# EAGLE design GRRVboardCGROUP2015 (EAGLE 7.4.0)
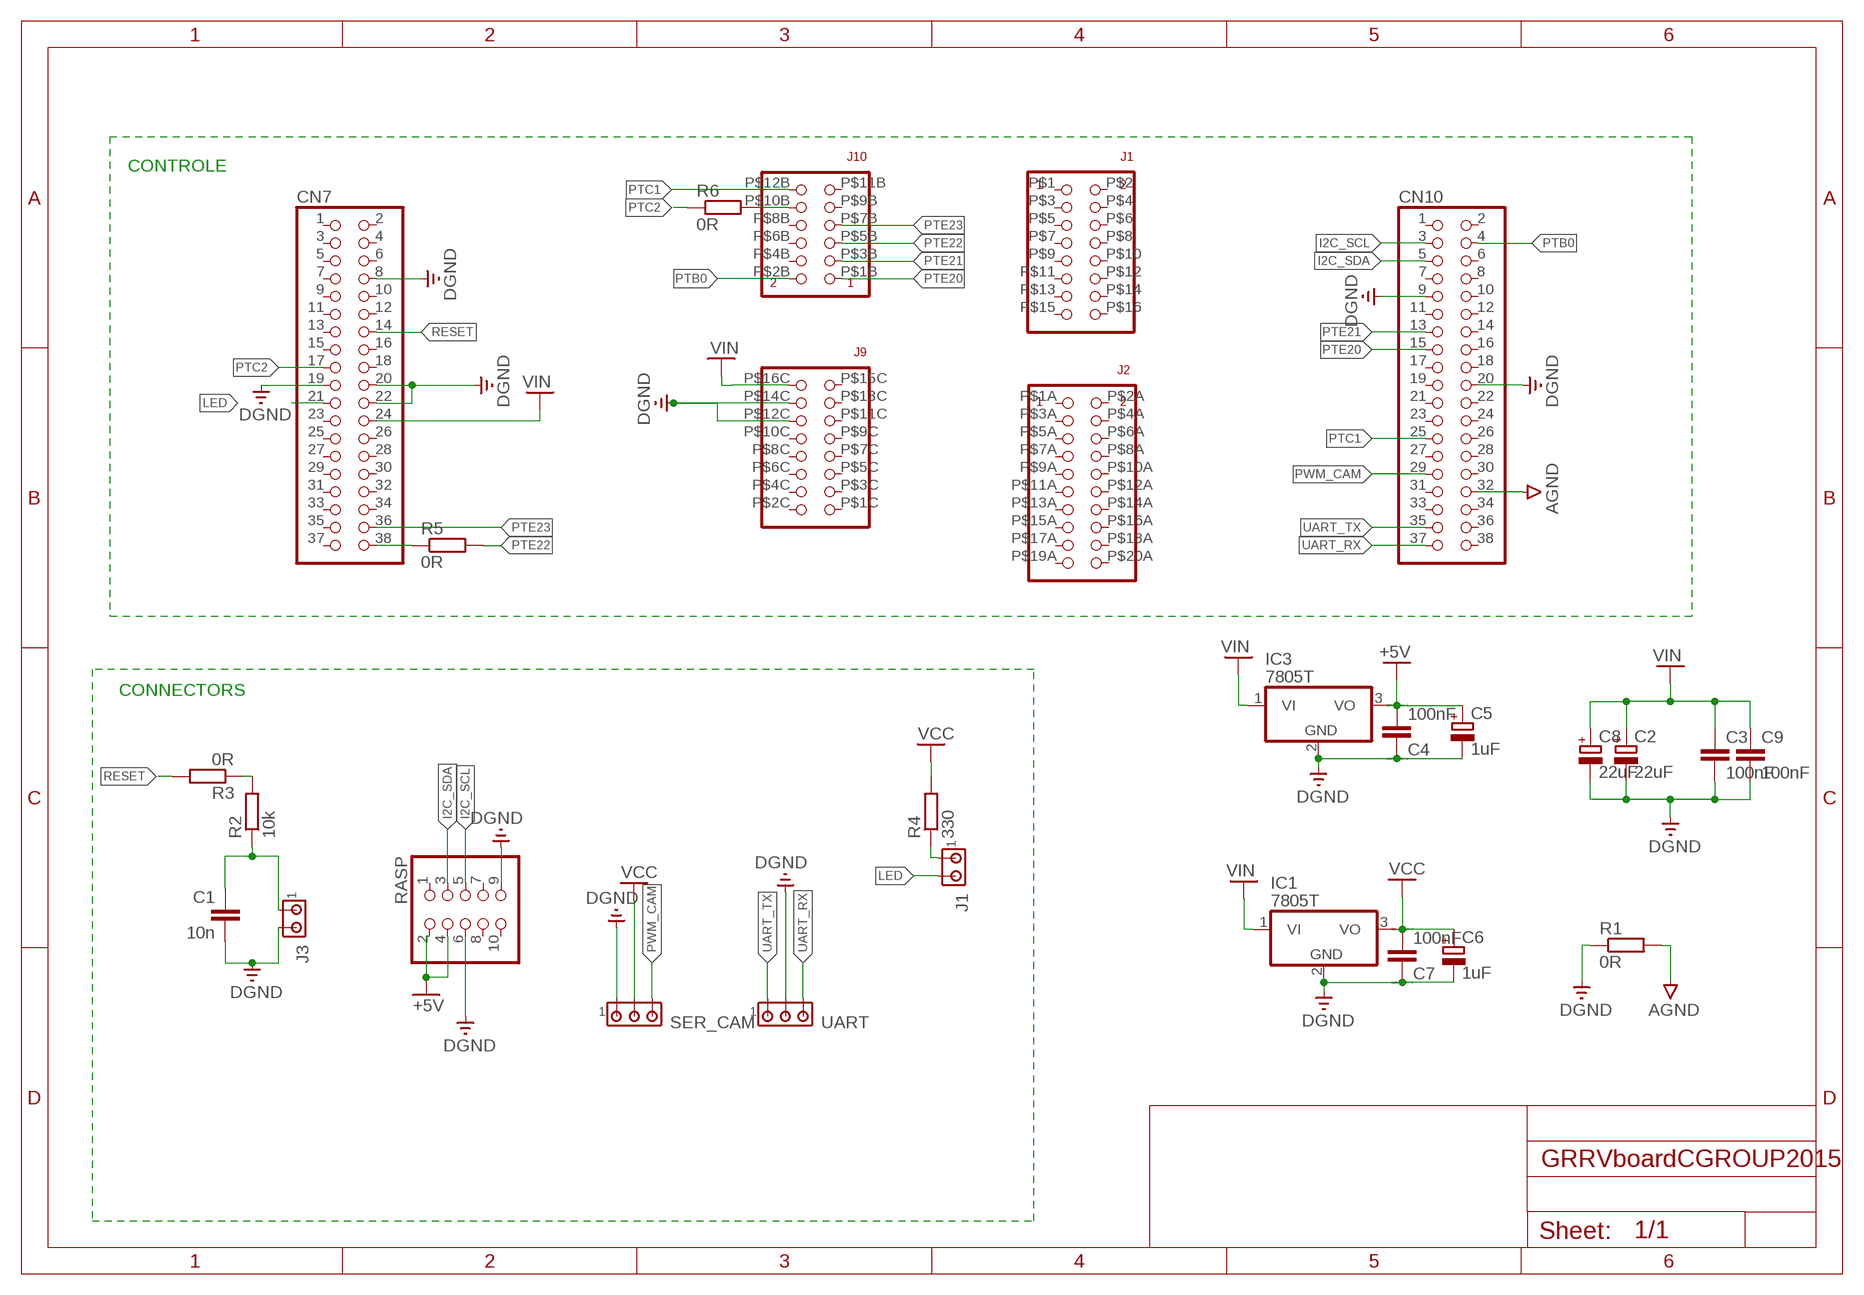
[diagram p0: schematic, sheet 1]

## Parts
C1  10n  C-EUC0805  [C0805]
C2  22uF  CPOL-EUSMCB  [SMC_B]
C3  100nF  C-EUC0805  [C0805]
C4  100nF  C  [C0805]
C5  1uF  CPOL-EUSMCB  [SMC_B]
C6  1uF  CPOL-EUSMCB  [SMC_B]
C7  100nF  C  [C0805]
C8  22uF  CPOL-EUSMCB  [SMC_B]
C9  100nF  C-EUC0805  [C0805]
CN7  PINHD-2X19  [2X19]
CN10  PINHD-2X19  [2X19]
IC1  7805T  [TO220H]
IC3  7805T  [TO220H]
J1  MTA02-100  [10X02MTA]
J3  MTA02-100  [10X02MTA]
R1  0R  R-EU_M1206  [M1206]
R2  10k  R-EU_M0805  [M0805]
R3  0R  R-EU_R0805  [R0805]
R4  330  R-EU_M0805  [M0805]
R5  0R  R-EU_R0805  [R0805]
R6  0R  R-EU_R0805  [R0805]
RASP  PINHD-2X5  [2X05]
SER_CAM  MTA03-100  [10X03MTA]
U$1  FRDM-TFC  [FRDM]
UART  MTA03-100  [10X03MTA]

## Nets
+5V: C4.2 C5.+ IC3.3(VO) RASP.2 RASP.4
AGND: CN10.32 R1.2
DGND: C1.2 C2.- C3.2 C4.1 C5.- C6.- C7.1 C8.- C9.2 CN7.8 CN7.19 CN7.20 CN7.22 CN10.9 CN10.20 IC1.2(GND) IC3.2(GND) J3.2 R1.1 RASP.6 RASP.9 SER_CAM.1 U$1.P$12C(12C) U$1.P$14C(14C) UART.2
I2C_SCL: CN10.3 RASP.5
I2C_SDA: CN10.5 RASP.3
LED: CN7.21 J1.2
N$3: CN7.38 R5.1
N$7: R2.2 R3.1
N$8: J1.1 R4.1
N$10: R6.2 U$1.P$10B(10B)
N$17: C1.1 J3.1 R2.1
PTB0: CN10.4 U$1.P$2B(2B)
PTC1: CN10.25 U$1.P$12B(12B)
PTC2: CN7.17 R6.1
PTE20: CN10.15 U$1.P$1B(1B)
PTE21: CN10.13 U$1.P$3B(3B)
PTE22: R5.2 U$1.P$5B(5B)
PTE23: CN7.36 U$1.P$7B(7B)
PWM_CAM: CN10.29 SER_CAM.3
RESET: CN7.14 R3.2
UART_RX: CN10.37 UART.3
UART_TX: CN10.35 UART.1
VCC: C6.+ C7.2 IC1.3(VO) R4.2 SER_CAM.2
VIN: C2.+ C3.1 C8.+ C9.1 CN7.24 IC1.1(VI) IC3.1(VI) U$1.P$16C(16C)
Unconnected: CN7.1 CN7.2 CN7.3 CN7.4 CN7.5 CN7.6 CN7.7 CN7.9 CN7.10 CN7.11 CN7.12 CN7.13 CN7.15 CN7.16 CN7.18 CN7.23 CN7.25 CN7.26 CN7.27 CN7.28 CN7.29 CN7.30 CN7.31 CN7.32 CN7.33 CN7.34 CN7.35 CN7.37 CN10.1 CN10.2 CN10.6 CN10.7 CN10.8 CN10.10 CN10.11 CN10.12 CN10.14 CN10.16 CN10.17 CN10.18 CN10.19 CN10.21 CN10.22 CN10.23 CN10.24 CN10.26 CN10.27 CN10.28 CN10.30 CN10.31 CN10.33 CN10.34 CN10.36 CN10.38 RASP.1 RASP.7 RASP.8 RASP.10 U$1.P$1 U$1.P$1A(1A) U$1.P$1C(1C) U$1.P$2 U$1.P$2A(2A) U$1.P$2C(2C) U$1.P$3 U$1.P$3A(3A) U$1.P$3C(3C) U$1.P$4 U$1.P$4A(4A) U$1.P$4B(4B) U$1.P$4C(4C) U$1.P$5 U$1.P$5A(5A) U$1.P$5C(5C) U$1.P$6 U$1.P$6A(6A) U$1.P$6B(6B) U$1.P$6C(6C) U$1.P$7 U$1.P$7A(7A) U$1.P$7C(7C) U$1.P$8 U$1.P$8A(8A) U$1.P$8B(8B) U$1.P$8C(8C) U$1.P$9 U$1.P$9A(9A) U$1.P$9B(9B) U$1.P$9C(9C) U$1.P$10 U$1.P$10A(10A) U$1.P$10C(10C) U$1.P$11 U$1.P$11A(11A) U$1.P$11B(11B) U$1.P$11C(11C) U$1.P$12 U$1.P$12A(12A) U$1.P$13 U$1.P$13A(13A) U$1.P$13C(13C) U$1.P$14 U$1.P$14A(14A) U$1.P$15 U$1.P$15A(15A) U$1.P$15C(15C) U$1.P$16 U$1.P$16A(16A) U$1.P$17A(17A) U$1.P$18A(18A) U$1.P$19A(19A) U$1.P$20A(20A)

## Notes on the sheet
- CONTROLE
- CONNECTORS

## Library data of the parts
C1 C3 C9 = resistor:C-EU: CAPACITOR, European symbol
C2 C5 C6 C8 = resistor:CPOL-EU: POLARIZED CAPACITOR, European symbol
C4 C7 = eagle-ltspice:C: CAPACITOR, European symbol; SPICEMODEL: NONE; SPICEPREFIX: C
CN7 CN10 = pinhead:PINHD-2X19: PIN HEADER
IC1 IC3 = linear:78*: Positive VOLTAGE REGULATOR Source: http://cache.national.com/ds/LM/LM78L05.pdf http://www.fairchildsemi.com/ds/LM/LM7805.pdf
J1 J3 = con-amp:MTA02-100: AMP connector
R1 R2 R4 = resistor:R-EU_: RESISTOR, European symbol
R3 R5 R6 = rcl:R-EU_: RESISTOR, European symbol
RASP = pinhead:PINHD-2X5: PIN HEADER
SER_CAM UART = con-amp:MTA03-100: AMP connector
U$1 = 21092015_projIntensif:FRDM-TFC

## Board
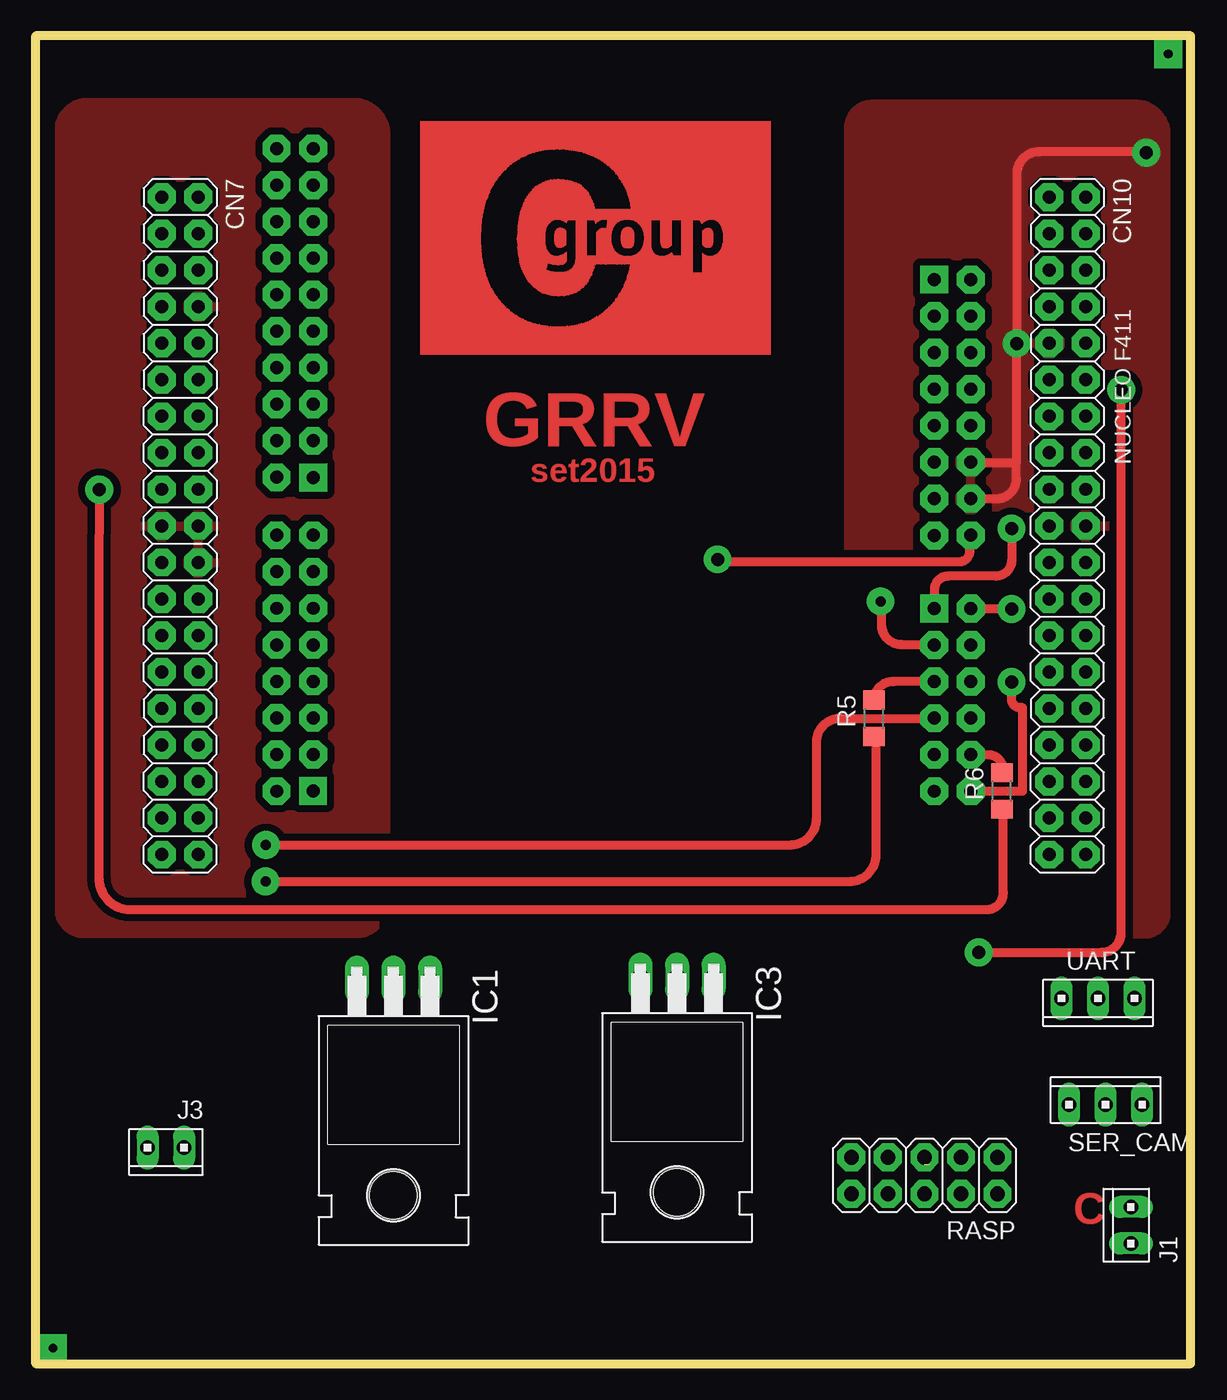
[diagram p1: board, top side]
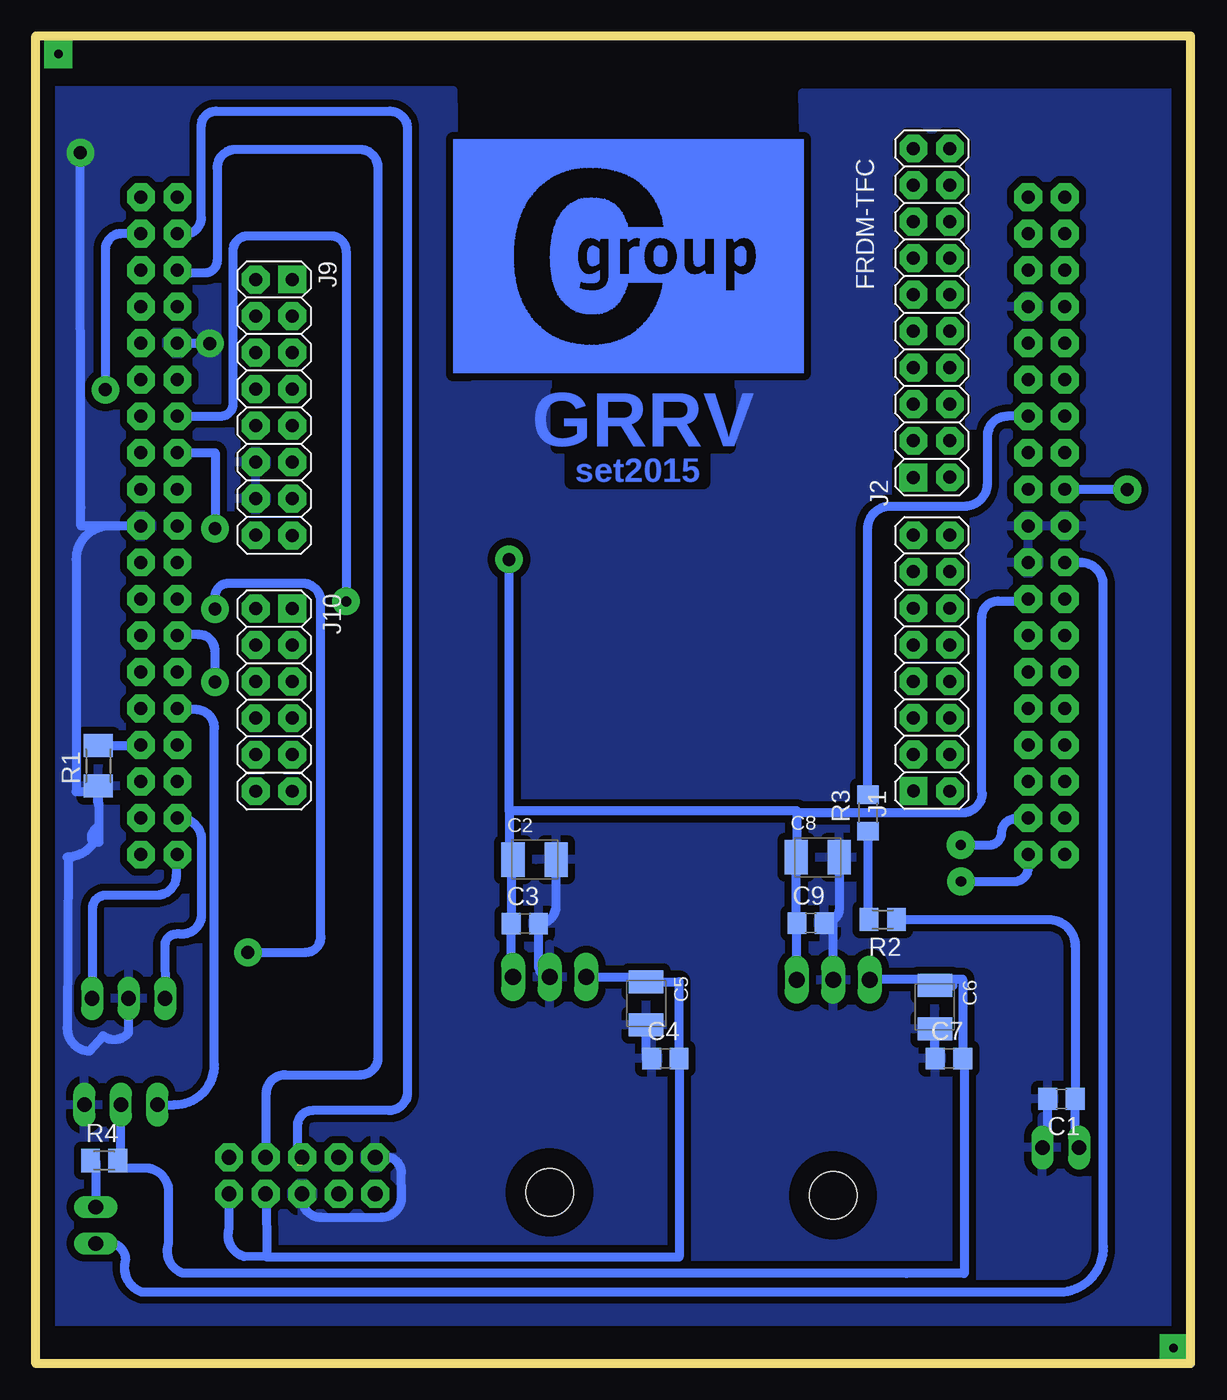
[diagram p2: board, bottom side, seen from below]

Size 80.26 x 92.32 mm. Coordinates in mm from the lower left corner, seen from the top.
Outline: 0,0 80.26,0 80.26,92.32 0,92.32 0,0
Copper layers (1*16): Top 0.035mm / dielectric 1.5mm / Bottom 0.035mm
Design rules "default *": minimum track width 10mil, minimum drill 24mil, track to track 8mil, track to pad 8mil, pad to pad 8mil, via to via 8mil, smd to smd 8mil, copper to edge 40mil, drill to drill 8mil, minimum pad ring 10mil, minimum via ring 8mil, stop-mask expansion 4mil, vias tented up to drill 0mil, thermal gap 20mil

### Footprints (pad centres in the part's own frame; a part is rotated, then mirrored left to right if it is on the bottom)
C0805 = smd 1.3 x 1.5: 1 -0.95,0; 2 0.95,0
SMC_B = smd 1.6 x 2.4: + -1.5,0; - 1.5,0
2X19 = drill 0.9 pad 1.93 octagon: 1 -22.86,-1.27; 2 -22.86,1.27; 3 -20.32,-1.27; 4 -20.32,1.27; 5 -17.78,-1.27; 6 -17.78,1.27; 7 -15.24,-1.27; 8 -15.24,1.27; 9 -12.7,-1.27; 10 -12.7,1.27; 11 -10.16,-1.27; 12 -10.16,1.27; 13 -7.62,-1.27; 14 -7.62,1.27; 15 -5.08,-1.27; 16 -5.08,1.27; 17 -2.54,-1.27; 18 -2.54,1.27; 19 0,-1.27; 20 0,1.27; 21 2.54,-1.27; 22 2.54,1.27; 23 5.08,-1.27; 24 5.08,1.27; 25 7.62,-1.27; 26 7.62,1.27; 27 10.16,-1.27; 28 10.16,1.27; 29 12.7,-1.27; 30 12.7,1.27; 31 15.24,-1.27; 32 15.24,1.27; 33 17.78,-1.27; 34 17.78,1.27; 35 20.32,-1.27; 36 20.32,1.27; 37 22.86,-1.27; 38 22.86,1.27
TO220H = drill 1.118 long: 1 -2.54,-10.16; 2 0,-10.16; 3 2.54,-10.16 | hole 3.302: 0,4.826
10X02MTA = drill 1.016 long: 1 1.27,0; 2 -1.27,0
M1206 = smd 1.6 x 2: 1 -1.4,0; 2 1.4,0
M0805 = smd 1.3 x 1.6: 1 -0.95,0; 2 0.95,0
R0805 = smd 1.3 x 1.5: 1 -1.268,0; 2 1.268,0
2X05 = drill 1.016 pad 1.93 octagon: 1 -5.08,-1.27; 2 -5.08,1.27; 3 -2.54,-1.27; 4 -2.54,1.27; 5 0,-1.27; 6 0,1.27; 7 2.54,-1.27; 8 2.54,1.27; 9 5.08,-1.27; 10 5.08,1.27
10X03MTA = drill 1.016 long: 1 2.54,0; 2 0,0; 3 -2.54,0
FRDM = drill 0.9 pad 1.93 square: P$1 22.378,21.774; P$1A 0.584,21.768; P$1B 9.703,-21.412; P$1C -13.183,-21.412 | drill 0.9 pad 1.93 octagon: P$2 22.402,24.311; P$2A 0.572,24.311; P$2B 9.702,-23.95; P$2C -13.178,-23.95; P$3 19.842,21.771; P$3A -1.968,21.771; P$3B 12.242,-21.41; P$3C -10.638,-21.41; P$4 19.842,24.311; P$4A -1.968,24.311; P$4B 12.242,-23.95; P$4C -10.638,-23.95; P$5 17.302,21.771; P$5A -4.508,21.771; P$5B 14.782,-21.41; P$5C -8.098,-21.41; P$6 17.302,24.311; P$6A -4.508,24.311; P$6B 14.782,-23.95; P$6C -8.098,-23.95; P$7 14.762,21.771; P$7A -7.048,21.771; P$7B 17.322,-21.41; P$7C -5.558,-21.41; P$8 14.762,24.311; P$8A -7.048,24.311; P$8B 17.322,-23.95; P$8C -5.558,-23.95; P$9 12.222,21.771; P$9A -9.588,21.771; P$9B 19.862,-21.41; P$9C -3.018,-21.41; P$10 12.222,24.311; P$10A -9.588,24.311; P$10B 19.862,-23.95; P$10C -3.018,-23.95; P$11 9.682,21.771; P$11A -12.128,21.771; P$11B 22.402,-21.409; P$11C -0.478,-21.41; P$12 9.682,24.311; P$12A -12.128,24.311; P$12B 22.402,-23.95; P$12C -0.478,-23.95; P$13 7.142,21.771; P$13A -14.668,21.771; P$13C 2.062,-21.41; P$14 7.142,24.311; P$14A -14.668,24.311; P$14C 2.062,-23.95; P$15 4.602,21.771; P$15A -17.208,21.771; P$15C 4.622,-21.41; P$16 4.602,24.311; P$16A -17.208,24.311; P$16C 4.602,-23.95; P$17A -19.748,21.771; P$18A -19.748,24.311; P$19A -22.288,21.771; P$20A -22.288,24.311

### Placement (x,y rotation side)
C1  8.98,18.41 180 bottom
C2  45.6,35.04 0 bottom
C3  46.27,30.59 0 bottom
C4  36.52,21.21 0 bottom
C5  37.85,25.04 270 bottom
C6  17.78,24.79 270 bottom
C7  16.79,21.22 0 bottom
C8  25.91,35.2 0 bottom
C9  26.42,30.63 0 bottom
CN7  10.02,58.25 270 top
CN10  71.7,58.25 270 top
IC1  24.85,16.53 180 top
IC3  44.56,16.73 180 top
J1  76.11,9.62 90 top
J3  9.03,15.03 180 top
R1  75.93,41.57 90 bottom
R2  21.4,30.88 180 bottom
R3  22.41,38.29 90 bottom
R4  75.52,14.11 0 bottom
R5  58.25,44.87 90 top
R6  67.14,39.82 90 top
RASP  61.76,13.07 180 top
SER_CAM  74.36,18 0 top
U$1  41.04,62.2 270 bottom
UART  73.82,25.39 180 top

### Tracks (layer width: path | path; a pad name or v marks a point on that pad's centre or on a via)
+5V
  Bottom 0.61: 64.21,7.41 65.81,7.45 arc90 66.84,9.39 RASP.2 | 64.21,7.41 35.56,7.41 C4.2 35.56,26.54 C5.+ 37.85,26.89 IC3.3 | RASP.4 64.25,11.8 64.21,7.41
AGND
  Bottom 0.61: R1.2 72.97,42.97 CN10.32
DGND  (via drill 0.9 pad 1.93)
  Top 0.61: 68.16,62.65 68.16,70.93 v68.18,70.93 68.18,82.72 arc-90 69.73,84.27 77.23,84.27 v77.17,84.19 | U$1.P$14C 66.76,60.14 arc90 68.16,61.54 68.16,62.65 | U$1.P$12C 64.99,62.65 68.16,62.65
  Bottom 0.61: J3.2 arc-90 9.93,15.4 C1.2 | RASP.6 61.74,11.39 arc-88 60.49,10.18 56.25,10.18 arc-91 54.84,11.6 54.86,13.28 arc-89 55.96,14.37 56.68,14.37 RASP.9 | CN10.9 68.18,70.95 v68.18,70.93 | UART.2 73.82,23.02 arc90 75.59,22.8 76.53,21.73 arc89 78.09,23.32 78.01,35.25 78.09,35.22 arc-91 75.9,37.44 75.93,39.95 R1.1 75.93,39.77 77.47,39.77 77.47,55.92 arc90 75.14,58.25 CN10.20 77.15,58.25 77.15,59.55 v77.17,84.19 | 76.03,37.24 arc-90 76.32,36.26 75.88,36.26 75.88,38.93 arc90 75.96,39.01 75.96,40.02 | 44.1,26.89 IC3.2 arc90 45.32,27.65 C3.2 arc-90 44.1,31.81 C2.- | C8.- 24.41,31.69 arc90 C9.2 24.85,30.63 IC1.2 | C7.1 17.78,21.22 C6.- | C4.1 37.85,21.21 C5.-
  pour Top (isolate 0.508): 1.58,31.67 1.58,85.66 arc-90 3.65,87.72 22.03,87.72 arc-90 24.32,85.43 24.32,32 arc-90 22.18,29.86 3.39,29.86 arc-90
  pour Top (isolate 0.508): 78.57,31.37 78.57,85.43 arc90 76.43,87.57 58.14,87.57 arc90 56.47,85.9 56.47,31.79 arc90 58.41,29.86 77.06,29.86 arc90
  pour Bottom (isolate 0.508): 78.39,88.53 51.29,88.53 50.92,69.39 26.52,69.39 26.96,88.37 0.67,88.37 0.96,2.9 78.82,2.9 79.27,88.55 78.27,88.55
I2C_SCL  (1 unrouted)
  Bottom 0.61: CN10.3 69.87,78.57 arc-90 68.77,79.67 68.77,86.08 arc90 67.76,87.09 55.67,87.09 arc90 54.44,85.86 54.44,18.87 arc90 55.72,17.59 61.05,17.59 arc-90 62.09,16.55 62.09,13.83 | 61.76,13.83 RASP.5
I2C_SDA
  Bottom 0.61: RASP.3 64.25,14.34 64.25,18.79 arc90 62.95,20.08 57.7,20.08 arc-90 56.47,21.3 56.47,83.15 arc-90 57.75,84.42 66.39,84.42 arc-90 67.68,83.14 67.68,76.69 arc90 68.53,75.84 70.43,75.84 CN10.5
LED
  Bottom 0.61: J1.2 75.14,8.35 arc90 74.03,7.24 74.03,7.21 arc-90 72.92,4.99 8.81,4.99 arc-90 6.08,8.41 6.08,54.17 arc-90 7.61,55.69 8.75,55.69 CN7.21
N$3  (via drill 0.7 pad 1.93)
  Top 0.61: v15.96,33.52 56.53,33.52 arc90 58.41,35.39 58.41,43.62 R5.1
  Bottom 0.61: v15.96,33.51 v15.96,33.52 15.96,33.49 12.31,33.49 arc-90 11.29,34.51 CN7.38
N$5  (via drill 0.6 pad 1.93)
  other vias: 1.19,1.08
N$6  (via drill 0.6 pad 1.93)
  other vias: 78.71,91.05
N$7
  Bottom 0.61: R2.2 22.41,30.88 R3.1
N$8
  Bottom 0.61: R4.1 76.11,14.11 J1.1
N$10
  Top 0.61: U$1.P$10B 66.2,42.34 arc-90 67.19,41.35 R6.2
N$17
  Bottom 0.61: J3.1 arc90 8.03,15.3 C1.1 8.03,29.04 arc-90 9.87,30.88 R2.1
PTB0  (via drill 0.9 pad 1.93)
  Top 0.61: v65.53,28.6 74.07,28.6 arc90 75.44,29.96 v75.44,67.71 | v67.82,52.47 64.99,52.47 U$1.P$2B
  Bottom 0.61: CN10.4 74.33,78.57 arc-90 75.44,77.46 v75.44,67.71 | v65.53,28.6 61.53,28.6 arc-90 60.45,29.67 60.45,52.98 arc-90 61.72,54.25 66.9,54.25 arc-90 67.82,53.33 v67.82,52.47
PTC1  (via drill 0.9 pad 1.93)
  Top 0.61: U$1.P$12B 68.58,39.8 68.58,45.61 68.39,45.61 arc-90 67.82,46.18 v67.82,47.39
  Bottom 0.61: v67.82,47.39 67.82,49.56 arc-90 68.95,50.69 70.43,50.69 CN10.25
PTC2  (via drill 0.9 pad 1.93)
  Top 0.61: R6.1 67.24,38.08 67.24,32.73 arc-90 66.07,31.56 6.56,31.56 arc-90 4.38,33.75 4.38,54.55 v4.4,60.77
  Bottom 0.61: CN7.17 4.4,60.8 v4.4,60.77 4.4,60.79 CN7.17
PTE20  (via drill 0.9 pad 1.93)
  Top 0.61: 62.42,52.5 U$1.P$1B 62.45,53.82 arc-90 63.4,54.76 66.74,54.76 arc90 67.82,55.84 v67.82,58.06
  Bottom 0.61: CN10.15 67.82,63.33 v67.82,58.06
PTE21  (via drill 0.7 pad 1.93)
  Top 0.61: v58.71,53 58.76,51.39 arc90 60.15,50 62.45,50 U$1.P$3B
  Bottom 0.61: CN10.13 67.52,65.87 arc-90 66.56,66.68 66.56,77.3 arc90 65.58,78.43 59.8,78.43 arc90 58.71,77.34 v58.71,53
PTE22
  Top 0.61: U$1.P$5B 59.6,47.42 arc90 R5.2
PTE23  (via drill 0.7 pad 1.93)
  Top 0.61: v15.99,36.06 52.39,36.06 arc90 54.27,37.93 54.27,43.22 arc-90 55.92,44.87 U$1.P$7B
  Bottom 0.61: v15.99,36.06 16.19,36.05 14,36.05 arc-90 13.14,36.91 arc90 12.16,37.89 11.29,37.89 CN7.36
PWM_CAM
  Bottom 0.61: SER_CAM.3 70.64,18 arc-90 67.85,20.78 67.85,44.16 arc-90 69.17,45.48 70.43,45.48 CN10.29
RESET
  Bottom 0.61: CN7.14 12.75,65.87 arc-90 14.13,64.49 14.13,61.21 arc90 15.73,59.6 20.91,59.6 arc-90 22.46,58.05 22.46,39.89 22.41,39.89 R3.2
UART_RX
  Bottom 0.61: CN10.37 70.52,35.39 70.52,33.93 arc90 71.89,32.55 75.55,32.55 arc-90 76.34,31.47 UART.3
UART_TX
  Bottom 0.61: CN10.35 arc90 68.77,36.58 68.77,31.08 arc90 70.25,29.86 70.52,29.86 arc-90 71.31,29.05 UART.1
VCC
  Bottom 0.61: 74.46,18 SER_CAM.2 74.36,14.11 R4.2 74.46,14.11 74.46,13.61 72.69,13.61 arc90 71.05,11.97 71.05,8.36 arc-90 70.07,6.3 19.76,6.3 | 16.51,26.72 15.84,26.72 C7.2 15.75,21.22 15.75,6.3 | 16.51,26.72 22.31,26.72 IC1.3 | 15.75,6.3 15.75,6.24 | 19.76,6.24 19.76,6.3 | 19.76,6.3 15.75,6.3 | C6.+ 16.51,26.29 16.51,26.72
VIN  (via drill 0.9 pad 1.93)
  Top 0.61: U$1.P$16C 64.91,57.6 64.91,56.63 arc-90 64.31,55.77 47.38,55.77 v47.38,55.92
  Bottom 0.61: 27.39,38.29 15.89,38.29 arc-90 14.49,39.7 14.51,39.7 14.51,51.9 arc90 13.39,53.03 11.29,53.03 CN7.24 | 47.38,38.43 v47.38,55.92 | IC3.1 47.22,26.89 C3.1 47.22,35.04 C2.+ 47.38,35.04 47.38,38.43 | IC1.1 27.37,26.69 C9.1 27.41,30.63 C8.+ 27.39,35.2 27.39,38.29 | 27.39,38.29 27.39,38.43 47.38,38.43
(copper drawn outside any net)
  shapes: Bottom area x3288, Top area x3288

### Text on the board
Top: C:/Users/Luana/Desktop/cgroup4.bmp | GRRV | set2015 | C
Bottom: C:/Users/Luana/Desktop/cgroup4.bmp | GRRV | set2015
tNames: NUCLEO F411